# EAGLE design PCA9536 (EAGLE 7.2.0)
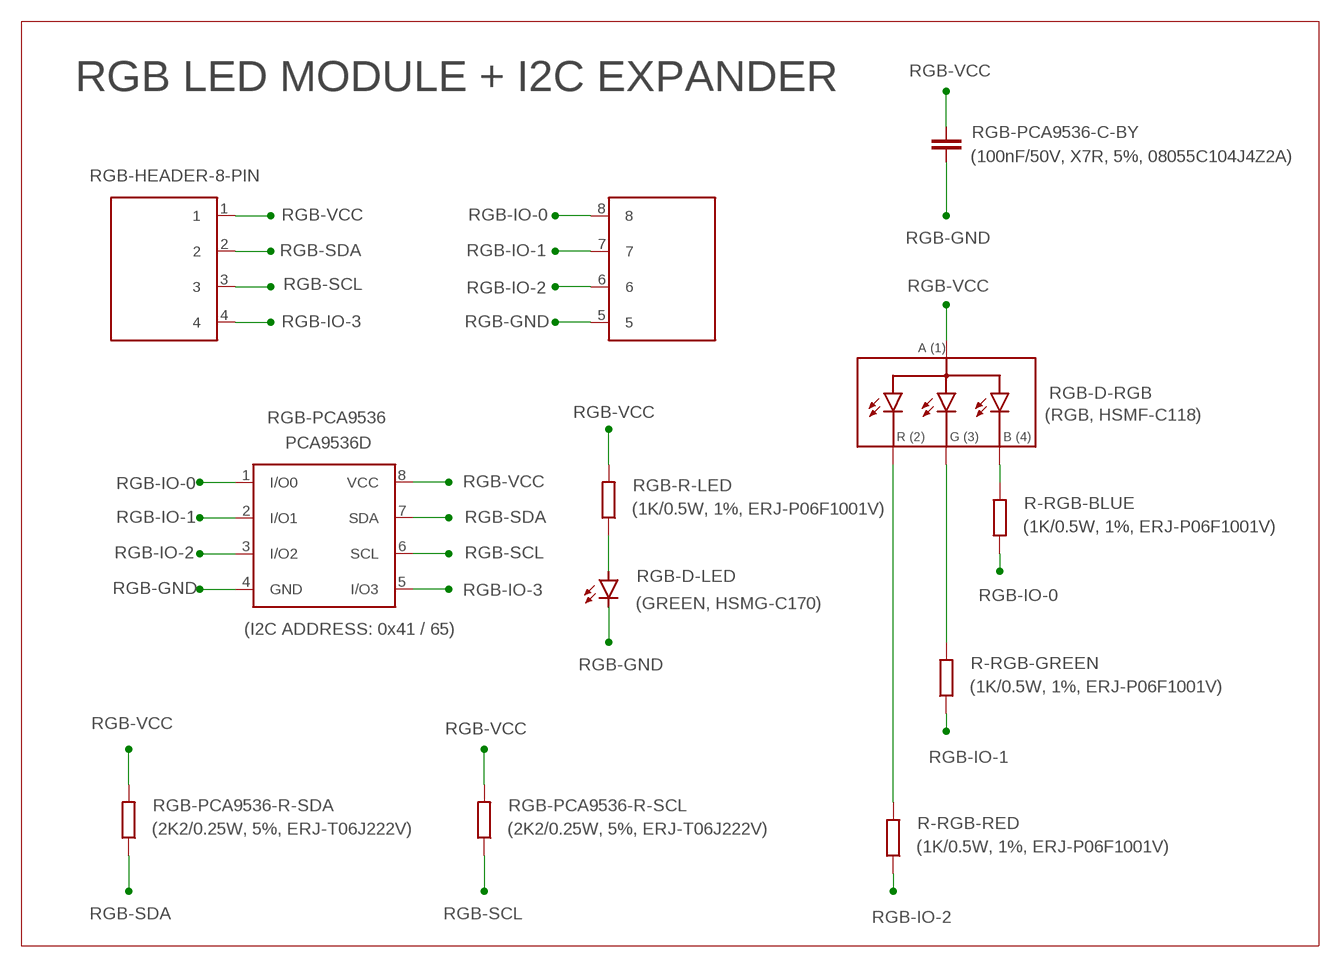
[diagram p0: schematic, sheet 1]

## Parts
R-RGB-BLUE  (1K/0.5W, 1%, ERJ-P06F1001V)  ERJ-P06F1001V  [0805]
R-RGB-GREEN  (1K/0.5W, 1%, ERJ-P06F1001V)  ERJ-P06F1001V  [0805]
R-RGB-RED  (1K/0.5W, 1%, ERJ-P06F1001V)  ERJ-P06F1001V  [0805]
RGB-D-LED  (GREEN, HSMG-C170)  HSMG-C170  [DIODE_0805]
RGB-D-RGB  (RGB, HSMF-C118)  HSMF-C118  [DIODE_LED_1210_RGB]
RGB-J1  RGB-HEADER-8-PIN  HEADER_8_PIN  [HEADER_2.54MM_8_PIN_VER]
RGB-PCA9536  PCA9536D  [SOIC-8-NARROW]
RGB-PCA9536-C-BY  (100nF/50V, X7R, 5%, 08055C104J4Z2A)  08055C104J4Z2A  [0805]
RGB-PCA9536-R-SCL  (2K2/0.25W, 5%, ERJ-T06J222V)  ERJ-T06J222V  [0805]
RGB-PCA9536-R-SDA  (2K2/0.25W, 5%, ERJ-T06J222V)  ERJ-T06J222V  [0805]
RGB-R-LED  (1K/0.5W, 1%, ERJ-P06F1001V)  ERJ-P06F1001V  [0805]

## Nets
RGB-GND: RGB-D-LED.C RGB-J1.5 RGB-PCA9536-C-BY.1(A) RGB-PCA9536.4(GND)
RGB-IO-0: R-RGB-BLUE.1 RGB-J1.8 RGB-PCA9536.1(I/O0)
RGB-IO-1: R-RGB-GREEN.1 RGB-J1.7 RGB-PCA9536.2(I/O1)
RGB-IO-2: R-RGB-RED.1 RGB-J1.6 RGB-PCA9536.3(I/O2)
RGB-IO-3: RGB-J1.4 RGB-PCA9536.5(I/O3)
RGB-POWER: RGB-D-LED.A RGB-R-LED.1
RGB-R-BLUE: R-RGB-BLUE.2 RGB-D-RGB.4
RGB-R-GREEN: R-RGB-GREEN.2 RGB-D-RGB.3
RGB-R-RED: R-RGB-RED.2 RGB-D-RGB.2
RGB-SCL: RGB-J1.3 RGB-PCA9536-R-SCL.1 RGB-PCA9536.6(SCL)
RGB-SDA: RGB-J1.2 RGB-PCA9536-R-SDA.1 RGB-PCA9536.7(SDA)
RGB-VCC: RGB-D-RGB.1 RGB-J1.1 RGB-PCA9536-C-BY.2(C) RGB-PCA9536-R-SCL.2 RGB-PCA9536-R-SDA.2 RGB-PCA9536.8(VCC) RGB-R-LED.2

## Notes on the sheet
- RGB LED MODULE + I2C EXPANDER
- (I2C ADDRESS: 0x41 / 65)

## Library data of the parts
R-RGB-BLUE R-RGB-GREEN R-RGB-RED RGB-R-LED = TDAR4:ERJ-P06F1001V: PANASONIC SMD RESISTOR THICK FILM 1K/0.5W, 1%, 100ppm, AEC-Q200, Automotive
RGB-D-LED = TDAR4:HSMG-C170: BROADCOM SMD DIODE LED (GREEN), 15mcd, 20mA, 2.2Vf, 170°, Diffused, Standard
RGB-D-RGB = TDAR4:HSMF-C118: BROADCOM SMD LED RGB, Common Anode, Diffused, Vf: 1.9/3.5/3.5V, If: 20mA, 90/20/40mcd, Standard http://www.avagotech.com/products/leds-and-displays/chip-leds/multi-color-surface-mount/hsmf-c118 MOUSER: 630-HSMF-C118 (HSMF-C118)
RGB-J1 = TDAR4:HEADER_8_PIN
RGB-PCA9536 = TDAR4:PCA9536: TEXAS INSTRUMENTS SMD IC I2C I/O EXPANDER, 4-CHANNEL, 4-BIT, Cf(max): 400MHz, Vdd: 2.3-5.5V Datasheet <http://www.mouser.com/ds/2/302/PCA9536-841631.pdf> Digikey: - Mouser: 771-PCA9536D-T (SOIC-8); 771-PCA9536DP-T (TSSOP-8) Farnell: - RS-Online: - I2C ADDRESS: 65 0x41 01000001
RGB-PCA9536-C-BY = TDAR4:08055C104J4Z2A: AVX SMD MLCC 0.1uF/50V, X7R, 5%, Flexible, Automotive
RGB-PCA9536-R-SCL RGB-PCA9536-R-SDA = TDAR4:ERJ-T06J222V: PANASONIC SMD RESISTOR THICK FILM 2K2/0.25W, 5%, 200ppm, AEC-Q200, Automotive

## Net classes
0 default: clearance 0.355 mm

## Board
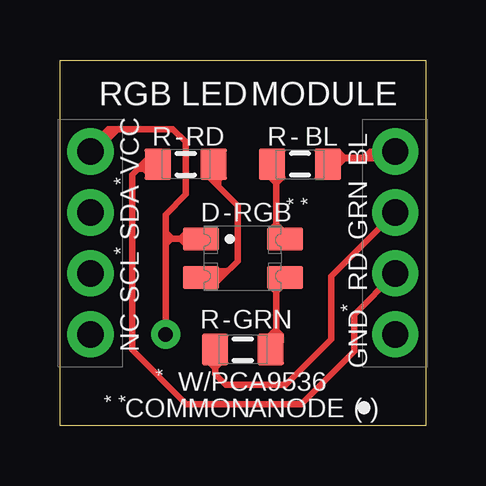
[diagram p1: board, top side]
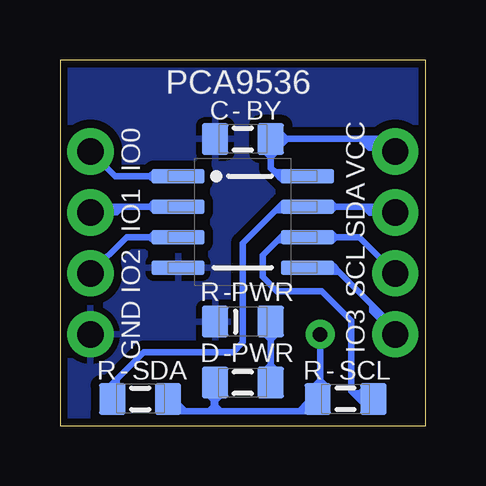
[diagram p2: board, bottom side, seen from below]

Size 15.24 x 15.24 mm. Coordinates in mm from the lower left corner, seen from the top.
Outline: 0,15.24 15.24,15.24 15.24,0 0,0 0,15.24
Copper layers (1*16): Top 0.035mm / dielectric 1.5mm / Bottom 0.035mm
Design rules "ITEADstudio_DRC *": minimum track width 10mil, minimum drill 12mil, track to track 10mil, track to pad 10mil, pad to pad 10mil, via to via 10mil, smd to smd 0mil, copper to edge 12mil, drill to drill 12mil, minimum pad ring 10mil, minimum via ring 6mil, stop-mask expansion 2mil, vias tented up to drill 100mil, thermal gap 10mil

### Footprints (pad centres in the part's own frame; a part is rotated, then mirrored left to right if it is on the bottom)
0805 = smd 1.1 x 1.3: 1 -1.16,0; 2 1.16,0
DIODE_0805 = smd 1.1 x 1.3: A 1.16,0; C -1.16,0
DIODE_LED_1210_RGB = smd 1.5 x 0.95: 1 1.75,-0.8; 2 1.75,0.8; 3 -1.75,0.8; 4 -1.75,-0.8
HEADER_2.54MM_8_PIN_VER = drill 1.1 pad 1.925: 1 -6.35,3.81; 2 -6.35,1.27; 3 -6.35,-1.27; 4 -6.35,-3.81; 5 6.35,-3.81; 6 6.35,-1.27; 7 6.35,1.27; 8 6.35,3.81
SOIC-8-NARROW = smd 2.2 x 0.6: 1 -2.7,1.905; 2 -2.7,0.635; 3 -2.7,-0.635; 4 -2.7,-1.905; 5 2.7,-1.905; 6 2.7,-0.635; 7 2.7,0.635; 8 2.7,1.905

### Placement (x,y rotation side)
R-RGB-BLUE  10,10.89 180 top
R-RGB-GREEN  7.62,3.17 0 top
R-RGB-RED  5.24,10.89 0 top
RGB-D-LED  7.62,4.34 0 bottom
RGB-D-RGB  7.62,6.99 180 top
RGB-J1  7.62,7.62 0 top
RGB-PCA9536  7.62,8.49 0 bottom
RGB-PCA9536-C-BY  7.62,11.95 0 bottom
RGB-PCA9536-R-SCL  3.34,1.12 180 bottom
RGB-PCA9536-R-SDA  11.9,1.12 0 bottom
RGB-R-LED  7.62,1.8 180 bottom

### Tracks (layer width: path | path; a pad name or v marks a point on that pad's centre or on a via)
RGB-GND
  pour Bottom (isolate 0.279): 0.16,15.08 15.08,15.08 15.08,0.16 0.16,0.16
RGB-IO-0
  Top 0.279: 11.61,10.9 11.61,11.4 11.86,11.15 11.61,10.9 | R-RGB-BLUE.1 11.16,11.15 13.97,11.15 RGB-J1.8 12.93,11.42 12.66,11.16 11.24,11.16 | 11.61,10.89 11.61,10.9 | 11.52,10.89 R-RGB-BLUE.1 | 11.61,10.9 11.6,10.89 R-RGB-BLUE.1
  Bottom 0.279: RGB-PCA9536.1 11.24,10.4 | 11.24,10.4 12.94,10.4 RGB-J1.8 | 11.32,10.55 11.32,10.25 11.47,10.4 11.32,10.55 | 11.32,10.55 11.24,10.47 11.24,10.4
RGB-IO-1
  Top 0.279: R-RGB-GREEN.1 6.46,2.56 | 6.46,2.56 6.46,2.14 6.9,1.7 9.4,1.7 11.3,3.6 11.3,6.22 RGB-J1.7 | 6.8,2.75 6.47,2.42 | 6.47,2.42 6.45,2.42 6.19,2.68 6.19,2.87 | 6.47,2.42 6.47,2.56 6.46,2.56
  Bottom 0.279: RGB-PCA9536.2 11.15,9.13 | 11.15,9.13 13.97,9.13 RGB-J1.7 | 11.3,8.97 11.3,9.27 11.45,9.12 11.3,8.97 | 11.3,8.97 11.15,9.12 11.15,9.13 | 10.73,9.15 10.87,9.29 11.33,9.29 11.44,9.18 11.44,9.08 11.32,8.97 11.11,8.97 11.02,9.05 11.09,9.12 11.2,9.12 | 11.2,9.12 12.64,9.12 12.87,8.89 RGB-J1.7 | 11.3,8.97 11.2,8.97 11.2,9.12
RGB-IO-2
  Top 0.279: 3.43,10.89 3,10.46 3,3.17 5.26,0.9 10.05,0.9 12.25,3.1 12.25,4.63 RGB-J1.6 | 3.43,10.89 R-RGB-RED.1 3.82,10.89 3.63,10.71 | 3.62,10.79 3.62,11.09 3.37,10.84 3.62,10.59 3.62,10.79 | 3.43,10.89 3.54,10.79 3.62,10.79 | 3.87,10.46 3.63,10.71 | 3.63,10.71 3.27,10.71
  Bottom 0.279: RGB-J1.6 12.46,7.86 RGB-PCA9536.3 10.34,7.84 10.6,7.84 10.62,7.82 11.3,7.82 | 11.3,7.82 11.3,8.01 11.45,7.86 11.3,7.71 | 11.3,7.82 11.3,7.71 | 10.59,7.79 10.69,7.7 11.2,7.7 | 11.2,7.7 11.32,7.7 11.48,7.86 11.32,8.02 10.9,8.02 | 11.3,7.71 11.21,7.71 11.2,7.7
RGB-IO-3
  Bottom 0.279: RGB-PCA9536.5 3.79,6.59 | 3.79,6.59 1.27,4.06 RGB-J1.4 1.29,3.81 2.23,4.76 2.23,5.03 3.63,6.43 4.43,6.43 4.6,6.6 | 3.79,6.59 3.81,6.57 3.93,6.57 3.93,6.73 3.78,6.58 3.92,6.44 | 4.23,6.43 4.23,6.44 3.92,6.44 | 3.92,6.44 3.67,6.44 | 3.99,6.49 4.11,6.49 4.06,6.44 3.92,6.44
RGB-POWER
  Bottom 0.279: 6.71,2.3 6.21,2.3 6.46,2.55 6.71,2.3 | 6.21,3.83 6.71,3.83 6.46,3.58 6.21,3.83 | 6.71,2.3 6.46,2.04 RGB-R-LED.1 RGB-D-LED.A 6.46,4.08 6.21,3.83
RGB-R-BLUE
  Top 0.279: 8.76,10.36 9.26,10.36 9.01,10.11 8.76,10.36 | 9.26,8.15 8.76,8.15 9.01,8.4 9.26,8.15 | 8.76,10.36 8.84,10.45 R-RGB-BLUE.2 8.9,10.89 9,10.79 9,7.79 RGB-D-RGB.4 9.26,7.9 9.26,8.15
RGB-R-GREEN
  Top 0.279: 9.26,5.83 8.76,5.83 9.01,5.58 9.26,5.83 | 8.7,3.7 9.2,3.7 8.95,3.95 | 8.7,3.7 8.95,3.95 | 8.7,3.7 8.78,3.62 R-RGB-GREEN.2 9,3.17 9,6.18 RGB-D-RGB.3 9.37,5.95 9.26,5.83 | 9.08,3.39 9.19,3.49 9.19,3.79 8.99,3.99 8.99,3.98 8.95,3.94 | 8.95,3.95 8.95,3.94 | 8.95,3.94 8.73,3.72
RGB-R-RED
  Top 0.279: RGB-D-RGB.2 6.72,6.18 | 6.72,6.18 7.4,6.87 7.4,9.16 6.4,10.16 | 6.4,10.16 R-RGB-RED.2 | 6.47,10.36 6.22,10.36 6.47,10.11 6.72,10.36 6.67,10.36 | 6.47,10.36 6.67,10.36 | 6.53,6.31 6.53,6 6.78,6.25 6.53,6.5 6.53,6.43 | 6.53,6.31 6.53,6.43 | 6.4,10.16 6.47,10.24 6.47,10.36 | 6.72,6.18 6.6,6.31 6.53,6.31 | 6.35,6.29 6.5,6.44 | 6.5,6.44 6.95,6.44 | 6.5,6.44 6.51,6.43 6.53,6.43 | 6.59,10.02 6.59,10.34 6.66,10.42 6.67,10.41 6.67,10.36
RGB-SCL
  Bottom 0.279: RGB-PCA9536.6 2.78,7.86 RGB-J1.3 | 6.04,7.86 6.8,7.1 6.8,6.2 6.21,5.61 4.34,5.61 3.1,4.37 3.1,1.44 | 6.04,7.86 RGB-PCA9536.6 | 3.1,1.44 3.1,1.43 2.79,1.12 RGB-PCA9536-R-SCL.1 | 3.94,7.9 3.94,7.71 3.79,7.86 3.94,8.01 | 3.94,7.9 3.94,8.01 | RGB-PCA9536.6 4.89,7.89 4.55,7.89 4.54,7.9 3.94,7.9 | 5.9,7.78 5.9,8 6.05,7.85 5.9,7.7 5.9,7.78 | 5.61,7.73 5.62,7.74 5.92,7.74 | 5.92,7.74 6.14,7.74 | 5.96,7.78 5.92,7.74 | 6.04,7.86 5.96,7.78 | 5.96,7.78 5.9,7.78 | 2.1,0.8 2.47,0.8 3.02,1.35 | 3.1,1.44 3.02,1.35 | 3.02,1.35 2.42,1.35 2.52,1.45 2.52,1.58 2.77,1.34 2.77,1.28 2.88,1.28 3.1,1.5 | 4.7,7.83 4.57,7.7 4.24,7.7 | 4.43,7.89 4.24,7.7 | 4.24,7.7 3.9,7.7 3.75,7.85 3.93,8.02 4.1,8.02 4.09,8.01 3.94,8.01
RGB-SDA
  Bottom 0.279: RGB-PCA9536.7 4.06,9.13 | 4.06,9.13 1.27,9.13 RGB-J1.2 1.59,8.89 1.6,8.88 | RGB-PCA9536.7 6.1,9.13 7.62,7.61 7.62,3.47 8.02,3.07 11.75,3.07 13.14,1.68 13.14,1.2 RGB-PCA9536-R-SDA.1 12.88,1.3 12.88,1.75 | 3.91,9.28 3.91,8.98 3.76,9.13 3.91,9.28 | 5.66,9.05 5.73,8.98 6.22,8.98 | 6.02,9.05 5.95,8.98 5.95,9.28 6.1,9.13 6.02,9.05 | RGB-PCA9536.7 4.9,9.11 4.86,9.11 4.92,9.05 5.66,9.05 | 6.02,9.05 5.66,9.05 | 3.91,9.28 4.06,9.13 | 12.69,1.35 12.69,1.52 12.76,1.6 12.76,1.63 12.88,1.75 | 12.88,1.75 12.88,1.9 | 4.36,9.09 4.32,9.13 2.58,9.13 2.34,8.88 1.6,8.88 | 1.6,8.88 RGB-J1.2
RGB-VCC  (via drill 0.6 pad 1.2)
  Top 0.279: RGB-D-RGB.1 5.87,7.82 | v4.4,3.81 4.4,7.79 | 4.4,7.79 4.4,8.8 5.24,9.64 5.24,11.82 4.7,12.37 2.21,12.37 2.17,12.33 | RGB-D-RGB.1 4.4,7.79 | 4.41,7.78 4.41,7.55 4.66,7.8 4.41,8.05 4.41,7.78 | 5.02,7.79 5.27,7.54 5.27,8.04 5.02,7.79 | 5.02,7.79 | 5.02,7.79 RGB-D-RGB.1 | 4.4,7.79 4.41,7.78 | 2.17,12.33 2.06,12.22 | 2.06,12.22 RGB-J1.1 | RGB-J1.1 1.5,11.44 | 1.59,11.53 2.4,12.35 | 1.5,11.44 1.48,11.42 | 1.48,11.42 RGB-J1.1 | 2.2,12.2 2.2,12.3 | 2.2,12.3 2.26,12.36 2.02,12.36 1.25,11.59 | 1.35,11.42 1.48,11.42 | 2.2,12.3 2.17,12.33 | 1.48,11.42 | RGB-J1.1 2.06,12.21 2.06,12.22 | RGB-J1.1 1.26,11.42 1.35,11.42 | RGB-J1.1 | 1.35,11.42 | 1.5,11.44 1.59,11.53 | 1.59,11.53 1.59,11.59 1.6,11.58 1.45,11.43 RGB-J1.1 | 1.43,11.43 1.4,11.4 | 1.5,11.5 1.43,11.43 | 1.43,11.43 RGB-J1.1 | 1.48,11.42 1.48,11.41 1.49,11.41 | 1.65,11.73 1.65,11.6 1.45,11.4 1.31,11.4 1.25,11.46 1.42,11.46 1.46,11.43 | 1.36,11.69 1.23,11.56 1.23,11.39 1.46,11.39 1.48,11.41 1.46,11.43 | 1.46,11.43 RGB-J1.1
  Bottom 0.279: RGB-PCA9536-C-BY.2 | 2.72,11.95 1.79,11.95 | RGB-PCA9536.8 6.1,10.4 | 6.1,10.4 6.26,10.56 | 6.46,10.76 RGB-PCA9536-C-BY.2 | RGB-PCA9536-R-SCL.2 4.5,0.6 8.78,0.6 | 8.78,0.6 10.74,0.6 RGB-PCA9536-R-SDA.2 10.74,0.94 10.7,0.89 10.3,0.89 10.02,0.61 | RGB-R-LED.2 8.78,0.6 | v4.4,3.81 4.4,1.12 RGB-PCA9536-R-SCL.2 | 8.8,0.6 8.54,0.6 8.79,0.85 9.04,0.6 8.8,0.6 | 8.88,0.68 8.83,0.73 | 8.83,0.73 8.83,1.03 8.8,1.07 8.8,1.27 | 8.8,1.27 9.05,1.27 8.8,1.02 8.55,1.27 8.8,1.27 | 8.78,0.6 8.83,0.65 8.83,0.73 | 8.83,0.73 8.8,0.7 8.8,0.6 | 4.5,1.64 4.15,1.64 4.4,1.89 4.65,1.64 4.5,1.64 | RGB-PCA9536-R-SCL.2 4.5,1.64 | 5.27,0.61 4.89,0.99 4.61,0.99 4.61,1.01 RGB-PCA9536-R-SCL.2 | 6.22,11.44 6.72,11.44 6.47,11.19 6.22,11.44 | 6.04,11.69 6.04,12.19 5.79,11.94 6.04,11.69 | 6.22,11.44 6.46,11.68 | 6.46,11.68 RGB-PCA9536-C-BY.2 | 6.46,11.68 6.49,11.7 6.56,11.7 6.55,11.69 6.04,11.69 | 5.97,10.37 5.97,10.55 5.99,10.52 | 5.97,10.37 5.97,10.25 6.12,10.4 5.99,10.52 | 5.48,10.45 5.55,10.52 5.99,10.52 | 5.99,10.52 6.15,10.52 | 6.1,10.4 6.07,10.37 5.97,10.37 | 6.5,12 RGB-PCA9536-C-BY.2 | RGB-PCA9536-C-BY.2 2.72,11.95 | 2.72,11.95 2.35,11.58 1.6,11.58 | 1.6,11.58 1.51,11.67 1.6,11.67 1.69,11.76 2.35,11.76 2.4,11.81 1.74,11.81 | RGB-J1.1 | 5.07,10.52 5.1,10.56 6.26,10.56 | 6.26,10.56 6.46,10.76 | 6.46,10.76 6.46,10.73 5.96,10.24 5.39,10.24 | RGB-J1.1 1.26,11.42 | 1.28,11.42 1.26,11.42 | 1.26,11.42 1.25,11.43 1.29,11.43 1.3,11.42 | RGB-J1.1 | 1.6,11.58 1.45,11.43 RGB-J1.1 | 1.66,11.58 1.47,11.4 | 1.47,11.4 1.39,11.4 1.24,11.4 1.79,11.95 1.96,11.95 | 1.47,11.4 1.44,11.43 RGB-J1.1

### Text on the board
tNames: RGB | LED | MODULE | VCC | R | - | RD | R | - | BL | BL | * | SDA | D | - | RGB | * | * | GRN | * | SCL | RD | * | NC | R | - | GRN | GND | * | W/PCA9536 | * | * | COMMON | ANODE | ( )
bNames: PCA9536 | BY | - | C | VCC | IO0 | SDA | IO1 | SCL | PWR | - | R | IO2 | IO3 | GND | PWR | - | D | SCL | - | R | SDA | - | R